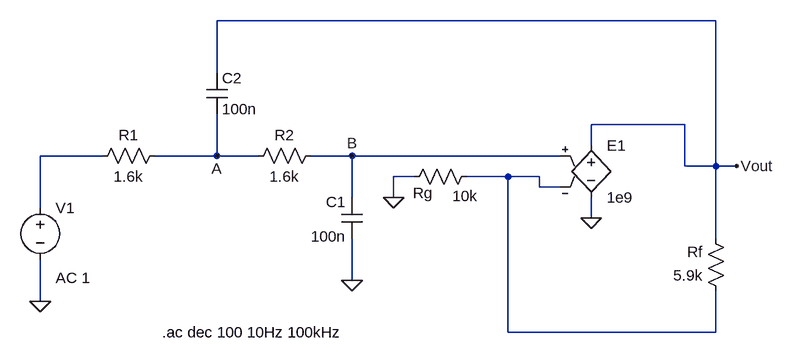
[diagram p0: schematic AFE_SallenKey_E_Source.asc]
AFE_SallenKey_E_Source.asc, the LTspice schematic file:
Version 4
SHEET 1 1048 724
WIRE 800 -96 32 -96
WIRE 32 -16 32 -96
WIRE 752 64 608 64
WIRE 608 96 608 64
WIRE -144 112 -240 112
WIRE 32 112 32 48
WIRE 32 112 -64 112
WIRE 96 112 32 112
WIRE 240 112 176 112
WIRE 560 112 240 112
WIRE 752 128 752 64
WIRE 800 128 800 -96
WIRE 800 128 752 128
WIRE 832 128 800 128
WIRE 336 144 304 144
WIRE 480 144 416 144
WIRE 528 144 480 144
WIRE 528 160 528 144
WIRE 560 160 528 160
WIRE 240 176 240 112
WIRE 304 176 304 144
WIRE -240 192 -240 112
WIRE 608 208 608 176
WIRE 800 240 800 128
WIRE 240 304 240 240
WIRE -240 336 -240 272
WIRE 480 384 480 144
WIRE 800 384 800 320
WIRE 800 384 480 384
FLAG 32 112 A
FLAG 240 112 B
FLAG -240 336 0
FLAG 240 304 0
FLAG 832 128 Vout
FLAG 608 208 0
FLAG 304 176 0
SYMBOL voltage -240 176 R0
WINDOW 123 24 124 Left 2
WINDOW 39 0 0 Left 0
SYMATTR InstName V1
SYMATTR Value ""
SYMATTR Value2 AC 1
SYMBOL res -48 96 R90
WINDOW 0 0 56 VBottom 2
WINDOW 3 32 56 VTop 2
SYMATTR InstName R1
SYMATTR Value 1.6k
SYMBOL res 192 96 R90
WINDOW 0 0 56 VBottom 2
WINDOW 3 32 56 VTop 2
SYMATTR InstName R2
SYMATTR Value 1.6k
SYMBOL cap 16 -16 R0
SYMATTR InstName C2
SYMATTR Value 100n
SYMBOL cap 224 176 R0
WINDOW 0 -24 7 Left 2
WINDOW 3 -47 60 Left 2
SYMATTR InstName C1
SYMATTR Value 100n
SYMBOL res 816 336 R180
WINDOW 0 36 76 Left 2
WINDOW 3 36 40 Left 2
SYMATTR InstName Rf
SYMATTR Value 5.9k
SYMBOL res 432 128 R90
WINDOW 0 57 83 VBottom 2
WINDOW 3 30 18 VTop 2
SYMATTR InstName Rg
SYMATTR Value 10k
SYMBOL e 608 80 R0
SYMATTR InstName E1
SYMATTR Value 1e9
TEXT 224 384 Right 2 !.ac dec 100 10Hz 100kHz

The netlist it stands for:
* AFE_SallenKey_E_Source.asc
V1 N001 0 AC 1
R1 A N001 1.6k
R2 B A 1.6k
C2 Vout A 100n
C1 B 0 100n
Rf N002 Vout 5.9k
Rg N002 0 10k
E1 Vout 0 B N002 1e9
.ac dec 100 10Hz 100kHz
.backanno
.end

* Results of the author's LTspice run, read from the files saved beside the schematic
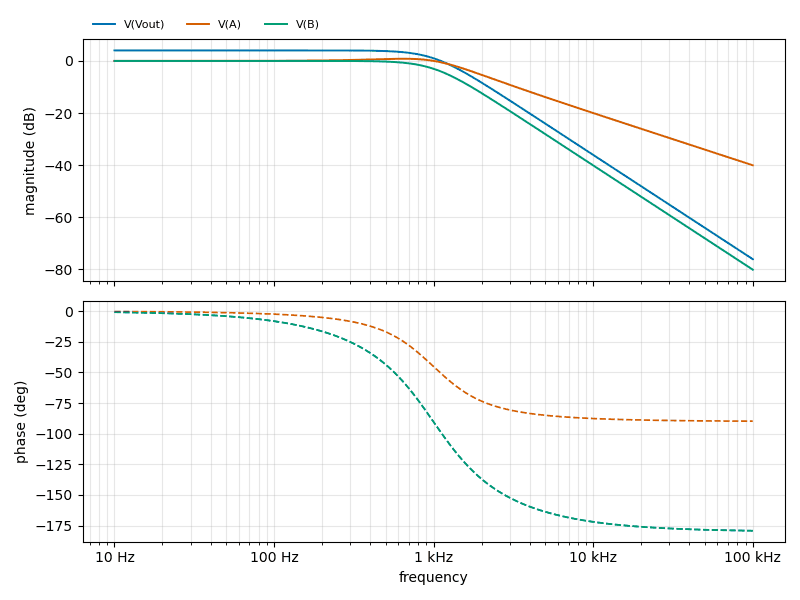
[diagram p1: AC Analysis of AFE_SallenKey_E_Source.asc, plotted from the saved traces]
* AC Analysis, 1 run:
*   V(Vout): 4.03 dB at 10 Hz, -76.06 dB at 100 kHz, peak 4.03 dB at 75.86 Hz, 3 dB below the peak at 997.6 Hz
*   V(A): 0.00 dB at 10 Hz, -40.05 dB at 100 kHz, peak 0.84 dB at 645.7 Hz, 3 dB below the peak at 1.403 kHz
*   V(B): 0.00 dB at 10 Hz, -80.09 dB at 100 kHz, peak 0.00 dB at 75.86 Hz, 3 dB below the peak at 997.6 Hz